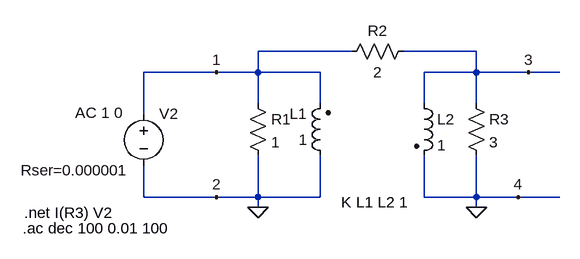
[diagram p0: schematic TS6_E1.asc]
TS6_E1.asc, the LTspice schematic file:
Version 4
SHEET 1 880 680
WIRE 256 32 112 32
WIRE 448 32 336 32
WIRE 48 64 -64 64
WIRE 112 64 112 32
WIRE 112 64 48 64
WIRE 208 64 112 64
WIRE 448 64 448 32
WIRE 448 64 368 64
WIRE 528 64 448 64
WIRE 576 64 528 64
WIRE 112 112 112 64
WIRE 208 112 208 64
WIRE 368 112 368 64
WIRE 448 112 448 64
WIRE -64 128 -64 64
WIRE -64 256 -64 208
WIRE 48 256 -64 256
WIRE 112 256 112 192
WIRE 112 256 48 256
WIRE 208 256 208 192
WIRE 208 256 112 256
WIRE 368 256 368 192
WIRE 448 256 448 192
WIRE 448 256 368 256
WIRE 512 256 448 256
WIRE 576 256 512 256
WIRE 112 272 112 256
WIRE 448 272 448 256
FLAG 112 272 0
FLAG 48 64 1
FLAG 48 256 2
FLAG 528 64 3
FLAG 512 256 4
FLAG 448 272 0
SYMBOL res 96 96 R0
SYMATTR InstName R1
SYMATTR Value 1
SYMBOL res 432 96 R0
SYMATTR InstName R3
SYMATTR Value 3
SYMBOL res 352 16 R90
WINDOW 0 0 56 VBottom 2
WINDOW 3 32 56 VTop 2
SYMATTR InstName R2
SYMATTR Value 2
SYMBOL ind2 224 208 R180
WINDOW 0 36 80 Left 2
WINDOW 3 36 40 Left 2
SYMATTR InstName L1
SYMATTR Value 1
SYMATTR Type ind
SYMBOL ind2 352 96 R0
SYMATTR InstName L2
SYMATTR Value 1
SYMATTR Type ind
SYMBOL voltage -64 112 R0
WINDOW 123 -105 14 Left 2
WINDOW 39 -189 103 Left 2
SYMATTR InstName V2
SYMATTR Value ""
SYMATTR Value2 AC 1 0
SYMATTR SpiceLine Rser=0.000001
TEXT 240 264 Left 2 !K L1 L2 1
TEXT -250 304 Left 2 !.ac dec 100 0.01 100
TEXT -248 280 Left 2 !.net I(R3) V2

The netlist it stands for:
* TS6_E1.asc
R1 1 0 1
R3 3 0 3
R2 3 1 2
L1 0 1 1
L2 3 0 1
V2 1 0 AC 1 0 Rser=0.000001
K L1 L2 1
.ac dec 100 0.01 100
.net I(R3) V2
.backanno
.end